# EasyEDA Pro project split-keyboard.epro, schematic Left top
Board Name: Left top; Create Date: 2025-12-19; Page Name: P1; Project Name: split-keyboard-2025; Schematic Name: Left top; Update Date: 2025-12-19; Company: EasyEDA.com; Page Size: A4; Version: V1.0
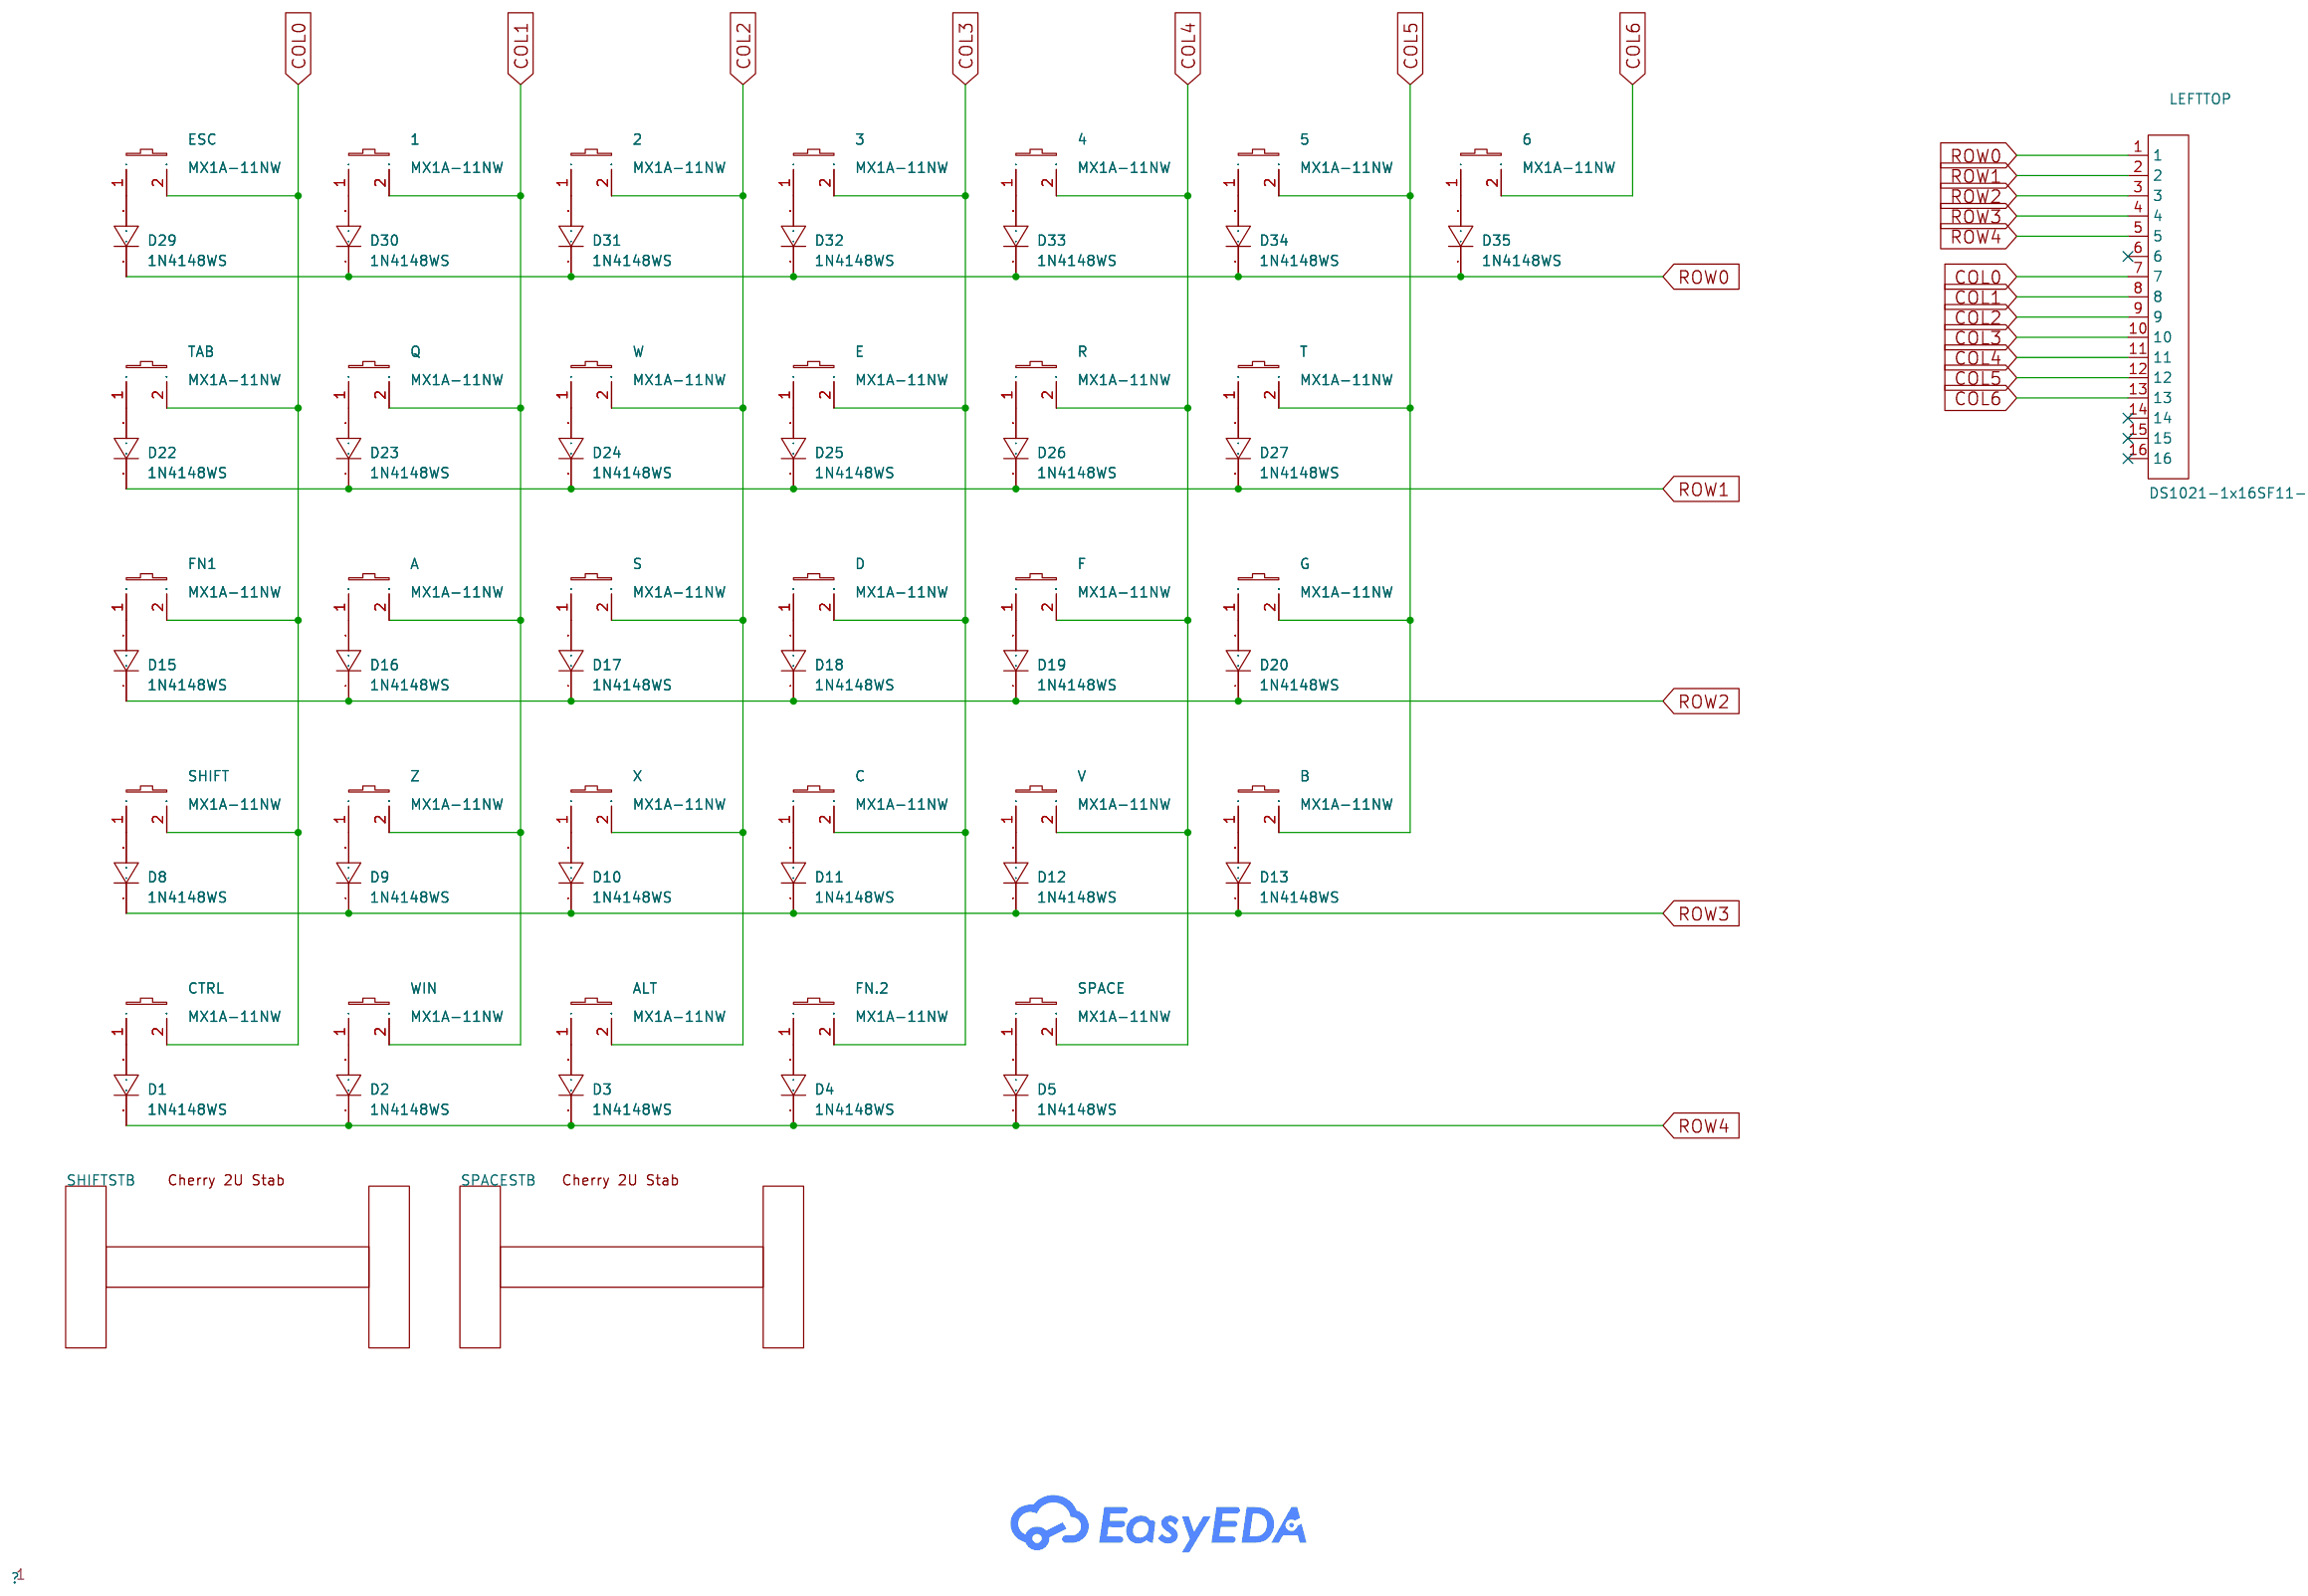
[diagram p1: schematic sheet]

## Parts
1  MX1A-11NW  [cherry]
2  MX1A-11NW  [cherry]
3  MX1A-11NW  [cherry]
4  MX1A-11NW  [cherry]
5  MX1A-11NW  [cherry]
6  MX1A-11NW  [cherry]
A  MX1A-11NW  [cherry]
ALT  MX1A-11NW  [cherry]
B  MX1A-11NW  [cherry]
C  MX1A-11NW  [cherry]
CTRL  MX1A-11NW  [cherry]
D  MX1A-11NW  [cherry]
D1  1N4148WS  [SOD-323_L1.8-W1.3-LS2.5-RD]
D2  1N4148WS  [SOD-323_L1.8-W1.3-LS2.5-RD]
D3  1N4148WS  [SOD-323_L1.8-W1.3-LS2.5-RD]
D4  1N4148WS  [SOD-323_L1.8-W1.3-LS2.5-RD]
D5  1N4148WS  [SOD-323_L1.8-W1.3-LS2.5-RD]
D8  1N4148WS  [SOD-323_L1.8-W1.3-LS2.5-RD]
D9  1N4148WS  [SOD-323_L1.8-W1.3-LS2.5-RD]
D10  1N4148WS  [SOD-323_L1.8-W1.3-LS2.5-RD]
D11  1N4148WS  [SOD-323_L1.8-W1.3-LS2.5-RD]
D12  1N4148WS  [SOD-323_L1.8-W1.3-LS2.5-RD]
D13  1N4148WS  [SOD-323_L1.8-W1.3-LS2.5-RD]
D15  1N4148WS  [SOD-323_L1.8-W1.3-LS2.5-RD]
D16  1N4148WS  [SOD-323_L1.8-W1.3-LS2.5-RD]
D17  1N4148WS  [SOD-323_L1.8-W1.3-LS2.5-RD]
D18  1N4148WS  [SOD-323_L1.8-W1.3-LS2.5-RD]
D19  1N4148WS  [SOD-323_L1.8-W1.3-LS2.5-RD]
D20  1N4148WS  [SOD-323_L1.8-W1.3-LS2.5-RD]
D22  1N4148WS  [SOD-323_L1.8-W1.3-LS2.5-RD]
D23  1N4148WS  [SOD-323_L1.8-W1.3-LS2.5-RD]
D24  1N4148WS  [SOD-323_L1.8-W1.3-LS2.5-RD]
D25  1N4148WS  [SOD-323_L1.8-W1.3-LS2.5-RD]
D26  1N4148WS  [SOD-323_L1.8-W1.3-LS2.5-RD]
D27  1N4148WS  [SOD-323_L1.8-W1.3-LS2.5-RD]
D29  1N4148WS  [SOD-323_L1.8-W1.3-LS2.5-RD]
D30  1N4148WS  [SOD-323_L1.8-W1.3-LS2.5-RD]
D31  1N4148WS  [SOD-323_L1.8-W1.3-LS2.5-RD]
D32  1N4148WS  [SOD-323_L1.8-W1.3-LS2.5-RD]
D33  1N4148WS  [SOD-323_L1.8-W1.3-LS2.5-RD]
D34  1N4148WS  [SOD-323_L1.8-W1.3-LS2.5-RD]
D35  1N4148WS  [SOD-323_L1.8-W1.3-LS2.5-RD]
E  MX1A-11NW  [cherry]
ESC  MX1A-11NW  [cherry]
F  MX1A-11NW  [cherry]
FN1  MX1A-11NW  [cherry]
FN.2  MX1A-11NW  [cherry]
G  MX1A-11NW  [cherry]
LEFTTOP  DS1021-1x16SF11-B  [HDR-TH_16P-P2.54-V-M]
Q  MX1A-11NW  [cherry]
R  MX1A-11NW  [cherry]
S  MX1A-11NW  [cherry]
SHIFT  MX1A-11NW  [cherry]
SHIFTSTB  -  [Cherry 2U Stabilizer Cutout]
SPACE  MX1A-11NW  [cherry]
SPACESTB  -  [Cherry 2U Stabilizer Cutout]
T  MX1A-11NW  [cherry]
TAB  MX1A-11NW  [cherry]
V  MX1A-11NW  [cherry]
W  MX1A-11NW  [cherry]
WIN  MX1A-11NW  [cherry]
X  MX1A-11NW  [cherry]
Z  MX1A-11NW  [cherry]

## Library data of the parts
1-6 A ALT B C CTRL D E ESC F FN1 FN.2 G Q R S SHIFT SPACE T TAB V W WIN X Z = MX1A-11NW: Supplier Part: C3316924; Manufacturer: CHERRY; JLCPCB Part Class: Extended Part; Datasheet: https://item.szlcsc.com/datasheet/MX1A-11NW/3881518.html; Supplier: LCSC
D1-D5 D8-D13 D15-D20 D22-D27 D29-D35 = 1N4148WS_C2128: Diode Configuration:Independent Voltage - Forward(Vf@If):1.25V@150mA Voltage - DC Reverse(Vr):100V Current - Rectified:150mA Pd - Power Dissipation:200mW Reverse Leakage Current (Ir):1uA@75V Reverse Recovery Time (trr):4ns Operating Junction Temperature R; LCSC Part Name: 丝印T4 1N4148WS; Supplier Part: C2128; Manufacturer: CJ(江苏长电/长晶); Supplier Footprint: SOD-323; JLCPCB Part Class: Basic Part; Datasheet: https://item.szlcsc.com/datasheet/1N4148WS/2485.html; Supplier: LCSC; Diode Configuration: Independent; Voltage - Forward(Vf@If): 1.25V@150mA; Voltage - DC Reverse(Vr): 100V; Current - Rectified: 150mA; Pd - Power Dissipation: 200mW; Reverse Leakage Current (Ir): 1uA@75V; Reverse Recovery Time (trr): 4ns; Non-Repetitive Peak Forward Surge Current: 2A
LEFTTOP = DS1021-1x16SF11-B: Pin Structure:1x16P Pitch:2.54mm Circluar Pins/Square Pins:Pin Header Mounting Type:Through Hole Number of Rows:1 Number of Pins:16P Current Rating:3A Voltage Rating (Max):250V Contact Material:Copper Alloy Contact Plating:Gold Operating Temperature:-40℃~; LCSC Part Name: 1x16P 间距:2.54mm 方针 直插; Supplier Part: C7430372; Manufacturer: CONNFLY; Supplier Footprint: 插件,P=2.54mm; JLCPCB Part Class: Extended Part; Datasheet: https://item.szlcsc.com/datasheet/DS1021-1x16SF11-B/8430025.html; Supplier: LCSC; Pin Structure: 1x16P; Pitch: 2.54mm; Circluar Pins/Square Pins: Pin Header; Mounting Type: Through Hole; Number of Rows: 1; Number of Pins: 16P; Current Rating: 3A; Voltage Rating (Max): 250V; Contact Material: Copper Alloy; Contact Plating: Gold; Operating Temperature: -40℃~+105℃; Color: Black
SHIFTSTB SPACESTB = Cherry 2u Stabilizer Cutout

## Nets
COL0: CTRL.2 ESC.2 FN1.2 LEFTTOP.7 SHIFT.2 TAB.2
COL1: 1.2 A.2 LEFTTOP.8 Q.2 WIN.2 Z.2
COL2: 2.2 ALT.2 LEFTTOP.9 S.2 W.2 X.2
COL3: 3.2 C.2 D.2 E.2 FN.2.2 LEFTTOP.10
COL4: 4.2 F.2 LEFTTOP.11 R.2 SPACE.2 V.2
COL5: 5.2 B.2 G.2 LEFTTOP.12 T.2
COL6: 6.2 LEFTTOP.13
ROW0: D29.1(K) D30.1(K) D31.1(K) D32.1(K) D33.1(K) D34.1(K) D35.1(K) LEFTTOP.1
ROW1: D22.1(K) D23.1(K) D24.1(K) D25.1(K) D26.1(K) D27.1(K) LEFTTOP.2
ROW2: D15.1(K) D16.1(K) D17.1(K) D18.1(K) D19.1(K) D20.1(K) LEFTTOP.3
ROW3: D8.1(K) D9.1(K) D10.1(K) D11.1(K) D12.1(K) D13.1(K) LEFTTOP.4
ROW4: D1.1(K) D2.1(K) D3.1(K) D4.1(K) D5.1(K) LEFTTOP.5
$1N668: CTRL.1 D1.2(A)
$1N5446: D2.2(A) WIN.1
$1N5517: ALT.1 D3.2(A)
$1N5588: D4.2(A) FN.2.1
$1N5659: D5.2(A) SPACE.1
$1N5872: D8.2(A) SHIFT.1
$1N5943: D9.2(A) Z.1
$1N6014: D10.2(A) X.1
$1N6085: C.1 D11.2(A)
$1N6156: D12.2(A) V.1
$1N6227: B.1 D13.2(A)
$1N6369: D15.2(A) FN1.1
$1N6440: A.1 D16.2(A)
$1N6511: D17.2(A) S.1
$1N6582: D.1 D18.2(A)
$1N6653: D19.2(A) F.1
$1N6724: D20.2(A) G.1
$1N6866: D22.2(A) TAB.1
$1N6937: D23.2(A) Q.1
$1N7008: D24.2(A) W.1
$1N7079: D25.2(A) E.1
$1N7150: D26.2(A) R.1
$1N7221: D27.2(A) T.1
$1N7363: D29.2(A) ESC.1
$1N7434: 1.1 D30.2(A)
$1N7505: 2.1 D31.2(A)
$1N7576: 3.1 D32.2(A)
$1N7647: 4.1 D33.2(A)
$1N7718: 5.1 D34.2(A)
$1N7789: 6.1 D35.2(A)

Not connected (* = marked no-connect by the designer): LEFTTOP 6* 14* 15* 16*
